# Altium schematic sheet SERIALIO.SCHDOC
size B
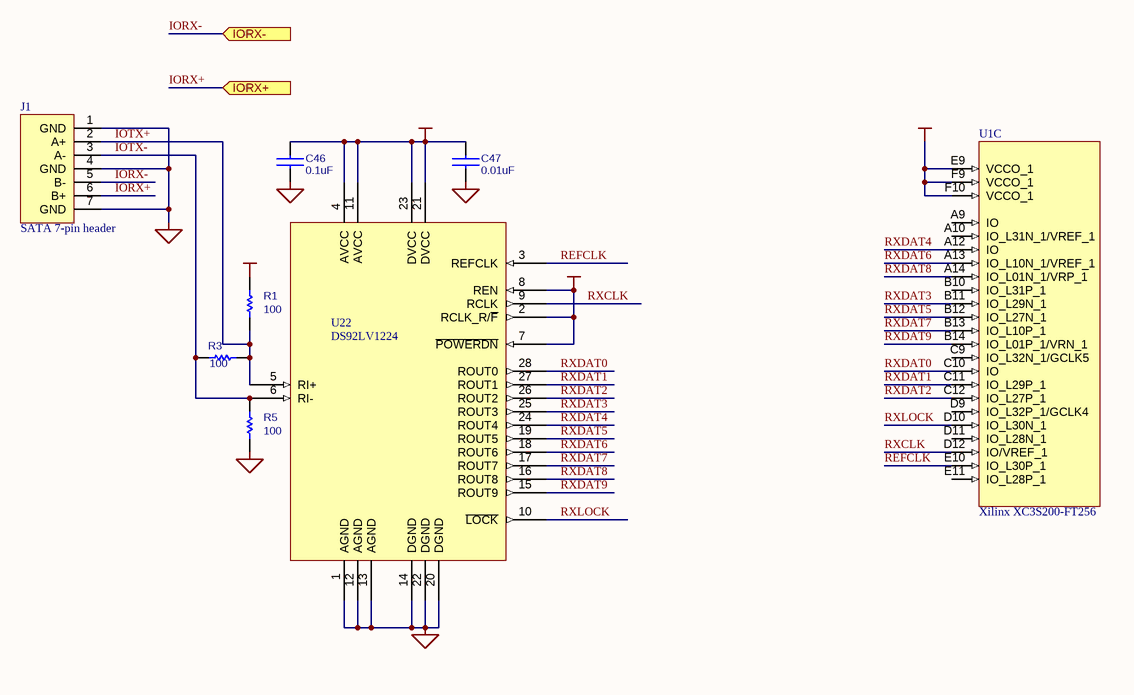
[diagram p0: SERIALIO.SCHDOC]

## Parts
C46  value 0.1uF  [0603]  (hidden comment: CAPACITOR)
C47  value 0.01uF  [0402]  (hidden comment: CAPACITOR)
J1  SATA 7-pin header  [MOLES 67800-5005]
R1  100  [0603]
R3  100  [0603]
R5  100  [0603]
U1  Xilinx XC3S200-FT256  [Xilinx FT256 BGA]  (part C of 9)
U22  DS92LV1224  [SSO-G28/E4.3]

## Ports
IORX+ (in), IORX- (in)

## Nets
GND: C46.1 C47.1 J1.1(GND) J1.4(GND) J1.7(GND) R5.1 U22.1(AGND) U22.12(AGND) U22.13(AGND) U22.14(DGND) U22.20(DGND) U22.22(DGND)
VCC: C46.2 C47.2 R1.1 U1.E9(VCCO_1) U1.F9(VCCO_1) U1.F10(VCCO_1) U22.2(RCLK_R/~{F}) U22.4(AVCC) U22.7(~{POWERDN}) U22.8(REN) U22.11(AVCC) U22.21(DVCC) U22.23(DVCC)
IORX+: J1.6(B+) ; port IORX+
IORX-: J1.5(B-) ; port IORX-
IOTX+: J1.2(A+) R1.2 R3.2 U22.5(RI+)
IOTX-: J1.3(A-) R3.1 R5.2 U22.6(RI-)
REFCLK: U1.E10(IO_L30P_1) U22.3(REFCLK)
RXCLK: U1.D12(IO/VREF_1) U22.9(RCLK)
RXDAT0: U1.C10(IO) U22.28(ROUT0)
RXDAT1: U1.C11(IO_L29P_1) U22.27(ROUT1)
RXDAT2: U1.C12(IO_L27P_1) U22.26(ROUT2)
RXDAT3: U1.B11(IO_L29N_1) U22.25(ROUT3)
RXDAT4: U1.A12(IO) U22.24(ROUT4)
RXDAT5: U1.B12(IO_L27N_1) U22.19(ROUT5)
RXDAT6: U1.A13(IO_L10N_1/VREF_1) U22.18(ROUT6)
RXDAT7: U1.B13(IO_L10P_1) U22.17(ROUT7)
RXDAT8: U1.A14(IO_L01N_1/VRP_1) U22.16(ROUT8)
RXDAT9: U1.B14(IO_L01P_1/VRN_1) U22.15(ROUT9)
RXLOCK: U1.D10(IO_L30N_1) U22.10(~{LOCK})

Not connected (* = marked no-connect by the designer): U1 A9(IO) A10(IO_L31N_1/VREF_1) B10(IO_L31P_1) C9(IO_L32N_1/GCLK5) D9(IO_L32P_1/GCLK4) D11(IO_L28N_1) E11(IO_L28P_1)

## Notes on the sheet
- Title:
- Engineer:
- Date:
- Revision:
- Sheet
- of
- File:

## Library data of the parts
C46 C47 = CAPACITOR: Standard Capacitor
J1 = SATA-7
R1 R3 R5 = RESISTOR: Standard Passive Resistor; Value: 100
U1 = XC3S200-FT256: Xilinx Spartan-3 FPGA
U22 = DS92LV1224: 30-66 MHz 10-Bit Bus LVDS Deserializer